# Altium schematic sheet POWER.SchDoc
size A3
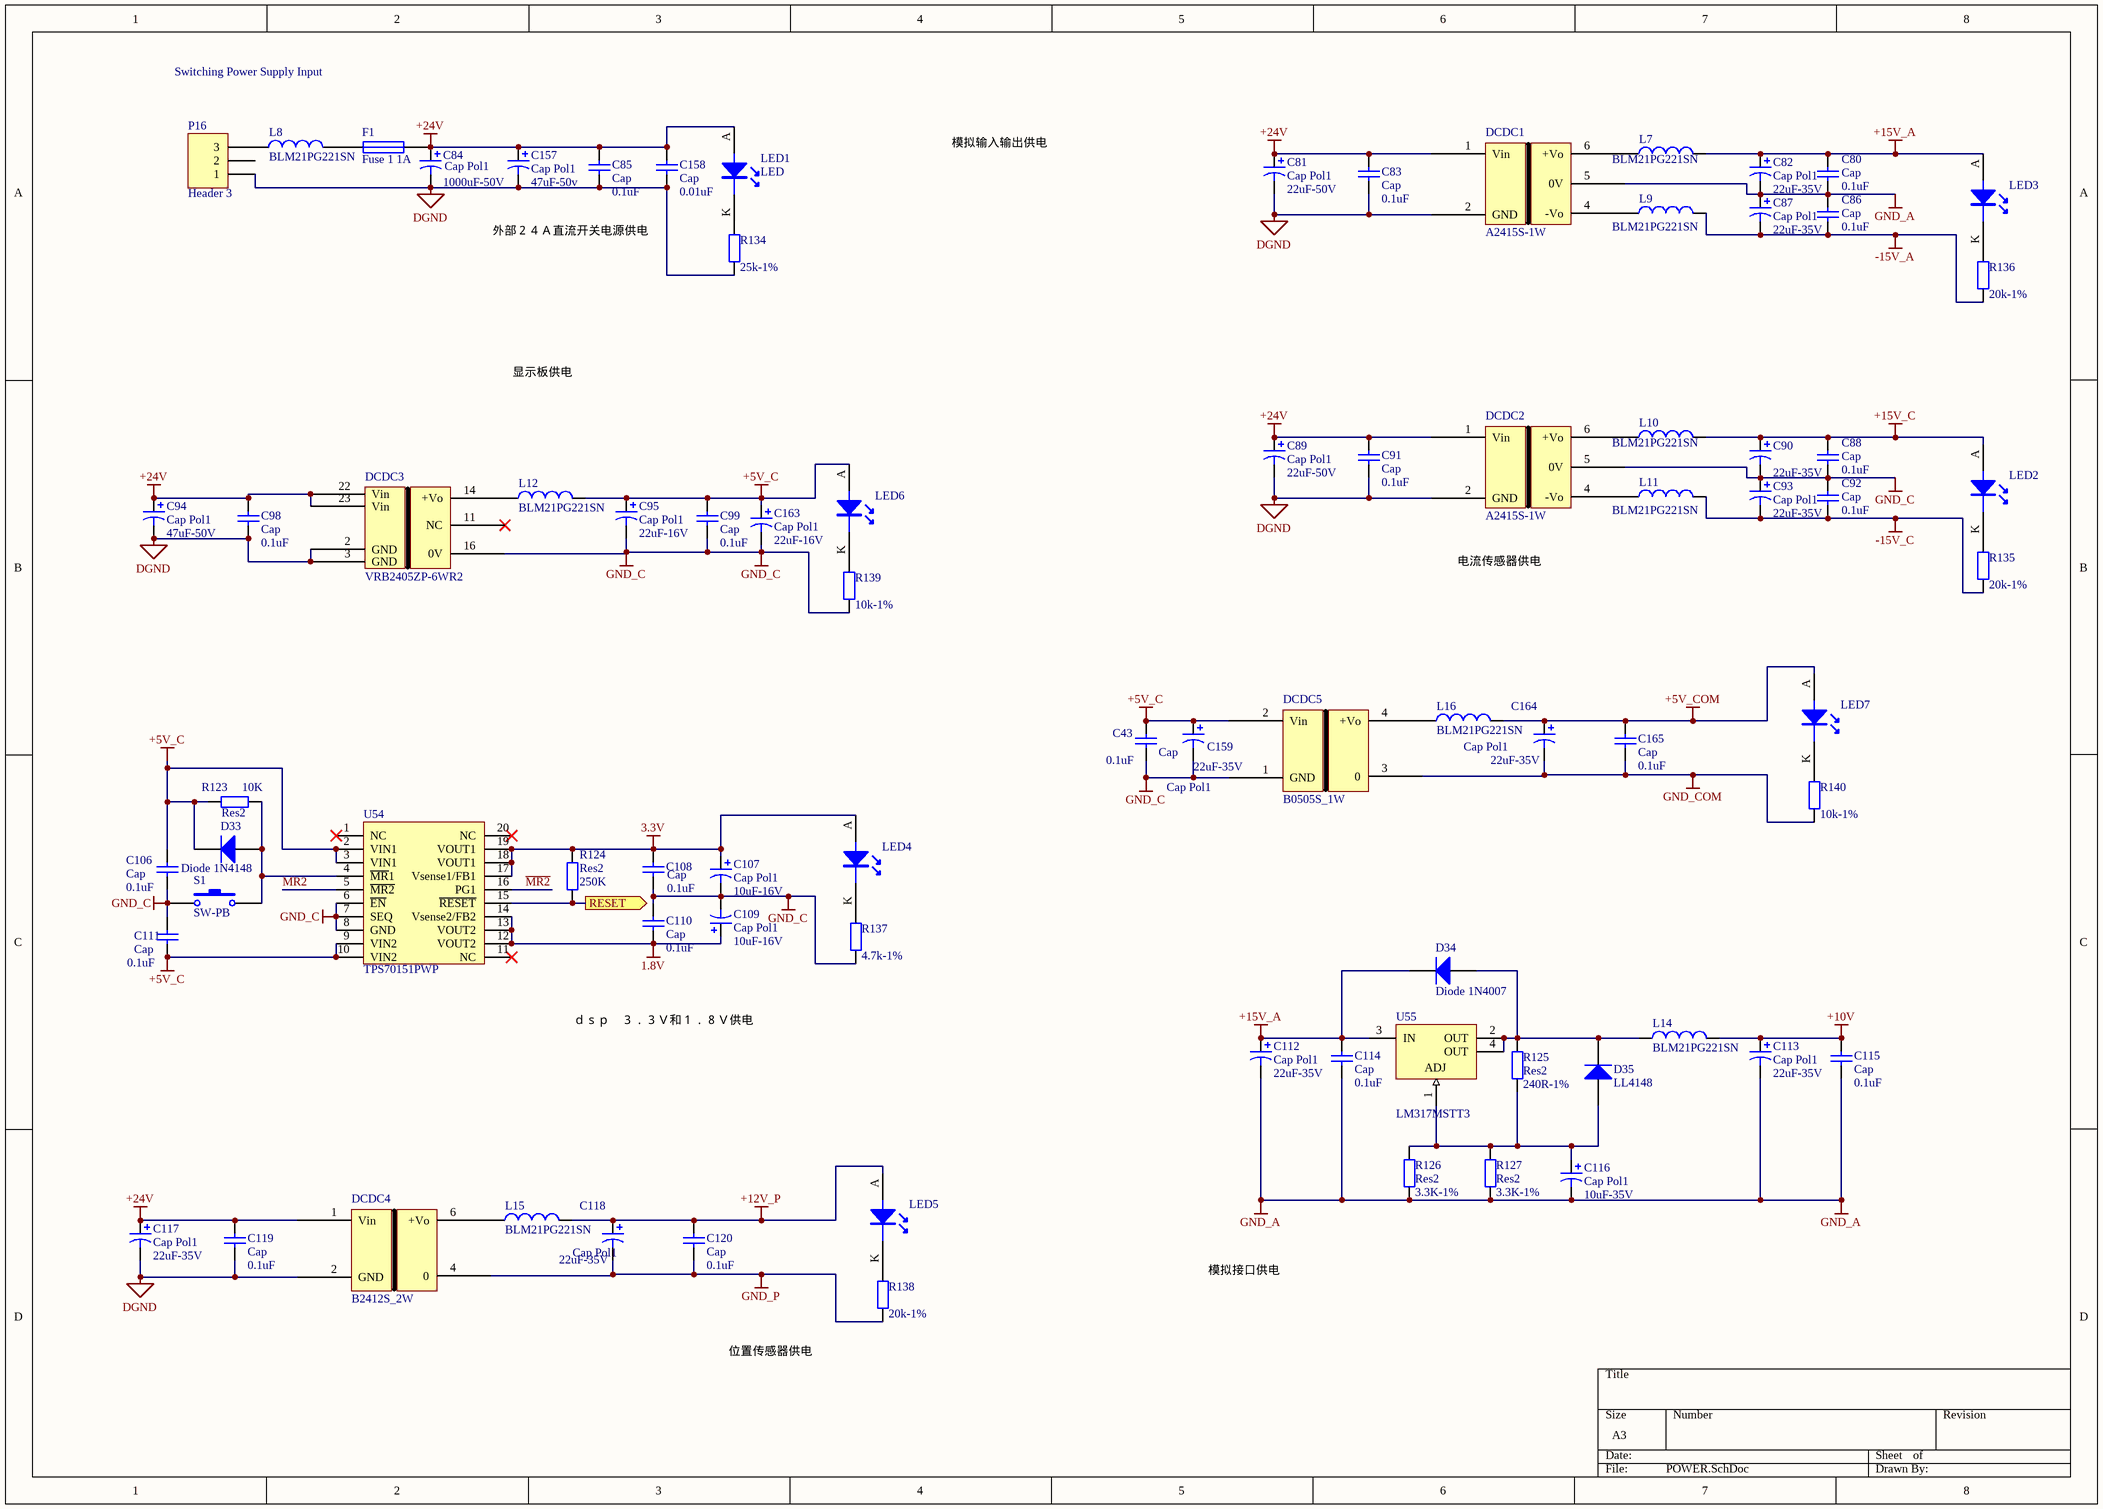
[diagram p0: POWER.SchDoc]

## Parts
C43  Cap  value 0.1uF  [1206]
C80  Cap  value 0.1uF  [1206]
C81  Cap Pol1  value 22uF-50V  [7343]
C82  Cap Pol1  value 22uF-35V  [7343]
C83  Cap  value 0.1uF  [1206]
C84  Cap Pol1  value 1000uF-50V  [电解电容1000uF]
C85  Cap  value 0.1uF  [1206]
C86  Cap  value 0.1uF  [1206]
C87  Cap Pol1  value 22uF-35V  [7343]
C88  Cap  value 0.1uF  [1206]
C89  Cap Pol1  value 22uF-50V  [7343]
C90  value 22uF-35V  [7343]  (hidden comment: Cap Pol1)
C91  Cap  value 0.1uF  [1206]
C92  Cap  value 0.1uF  [1206]
C93  Cap Pol1  value 22uF-35V  [7343]
C94  Cap Pol1  value 47uF-50V  [电解电容47uf]
C95  Cap Pol1  value 22uF-16V  [7343]
C98  Cap  value 0.1uF  [1206]
C99  Cap  value 0.1uF  [1206]
C106  Cap  value 0.1uF  [1206]
C107  Cap Pol1  value 10uF-16V  [1206]
C108  Cap  value 0.1uF  [1206]
C109  Cap Pol1  value 10uF-16V  [1206]
C110  Cap  value 0.1uF  [1206]
C111  Cap  value 0.1uF  [1206]
C112  Cap Pol1  value 22uF-35V  [7343]
C113  Cap Pol1  value 22uF-35V  [7343]
C114  Cap  value 0.1uF  [1206]
C115  Cap  value 0.1uF  [1206]
C116  Cap Pol1  value 10uF-35V  [1206]
C117  Cap Pol1  value 22uF-35V  [7343]
C118  Cap Pol1  value 22uF-35V  [7343]
C119  Cap  value 0.1uF  [1206]
C120  Cap  value 0.1uF  [1206]
C157  Cap Pol1  value 47uF-50v  [电解电容47uf]
C158  Cap  value 0.01uF  [1206]
C159  Cap Pol1  value 22uF-35V  [7343]
C163  Cap Pol1  value 22uF-16V  [7343]
C164  Cap Pol1  value 22uF-35V  [7343]
C165  Cap  value 0.1uF  [1206]
D33  Diode 1N4148  [SOD-80/MLL34]
D34  Diode 1N4007  [SMA]
D35  LL4148  [SMA]
DCDC1  A2415S-1W  [NPSIP7]
DCDC2  A2415S-1W  [NPSIP7]
DCDC3  VRB2405ZP-6WR2  [DIP24]
DCDC4  B2412S_2W  [NPSIP7A_B2412s2]
DCDC5  B0505S_1W  [B0505]
F1  Fuse 1 1A  [1206]
L7  BLM21PG221SN  [2012]
L8  BLM21PG221SN  [2012]
L9  BLM21PG221SN  [2012]
L10  BLM21PG221SN  [2012]
L11  BLM21PG221SN  [2012]
L12  BLM21PG221SN  [2012]
L14  BLM21PG221SN  [2012]
L15  BLM21PG221SN  [2012]
L16  BLM21PG221SN  [2012]
LED1  LED  [0805D]
LED2  LED  [0805D]  (value not drawn)
LED3  LED  [0805D]  (value not drawn)
LED4  LED  [0805D]  (value not drawn)
LED5  LED  [0805D]  (value not drawn)
LED6  LED  [0805D]  (value not drawn)
LED7  LED  [0805D]  (value not drawn)
P16  Header 3  [PHENOX-3]
R123  Res2  value 10K  [1206]
R124  Res2  value 250K  [1206]
R125  Res2  value 240R-1%  [1206]
R126  Res2  value 3.3K-1%  [1206]
R127  Res2  value 3.3K-1%  [1206]
R134  value 25k-1%  [1206]  (hidden comment: Res2)
R135  value 20k-1%  [1206]  (hidden comment: Res2)
R136  value 20k-1%  [1206]  (hidden comment: Res2)
R137  value 4.7k-1%  [1206]  (hidden comment: Res2)
R138  value 20k-1%  [1206]  (hidden comment: Res2)
R139  value 10k-1%  [1206]  (hidden comment: Res2)
R140  value 10k-1%  [1206]  (hidden comment: Res2)
S1  SW-PB  [B3F4050]
U54  TPS70151PWP  [tssop20]
U55  LM317MSTT3  [SOT223-4N]

## Ports
RESET (out)

## Nets
1.8V: C109.1 C110.1 U54.12(VOUT2) U54.13(VOUT2) U54.14(Vsense2/FB2)
3.3V: C107.1 C108.2 LED4.A R124.2 U54.17(Vsense1/FB1) U54.18(VOUT1) U54.19(VOUT1)
+5V_C: C43.2 C95.1 C99.2 C106.2 C111.1 C159.1 C163.1 D33.2(K) DCDC5.2(Vin) L12.2 LED6.A R123.2 U54.2(VIN1) U54.3(VIN1) U54.9(VIN2) U54.10(VIN2)
+5V_COM: C164.1 C165.2 L16.2 LED7.A
+10V: C113.1 C115.2 L14.2
+12V_P: C118.1 C120.2 L15.2 LED5.A
+15V_A: C80.2 C82.1 C112.1 C114.2 D34.2(K) L7.2 LED3.A U55.3(IN)
+15V_C: C88.2 C90.1 L10.2 LED2.A
+24V: C81.1 C83.2 C84.1 C85.2 C89.1 C91.2 C94.1 C98.2 C117.1 C119.2 C157.1 C158.1 DCDC1.1(Vin) DCDC2.1(Vin) DCDC3.22(Vin) DCDC3.23(Vin) DCDC4.1(Vin) F1.2 LED1.A
-15V_A: C86.1 C87.2 L9.2 R136.1
-15V_C: C92.1 C93.2 L11.2 R135.1
DGND: C81.2 C83.1 C84.2 C85.1 C89.2 C91.1 C94.2 C98.1 C117.2 C119.1 C157.2 C158.2 DCDC1.2(GND) DCDC2.2(GND) DCDC3.2(GND) DCDC3.3(GND) DCDC4.2(GND) P16.1 R134.1
GND_A: C80.1 C82.2 C86.2 C87.1 C112.2 C113.2 C114.1 C115.1 C116.2 DCDC1.5(0V) R126.1 R127.1
GND_C: C43.1 C88.1 C90.2 C92.2 C93.1 C95.2 C99.1 C106.1 C107.2 C108.1 C109.2 C110.2 C111.2 C159.2 C163.2 DCDC2.5(0V) DCDC3.16(0V) DCDC5.1(GND) R137.1 R139.1 S1.1 U54.6(~{EN}) U54.7(SEQ) U54.8(GND)
GND_COM: C164.2 C165.1 DCDC5.3(0) R140.1
GND_P: C118.2 C120.1 DCDC4.4(0) R138.1
~{MR2}: U54.5(~{MR2}) U54.16(PG1)
RESET: R124.1 U54.15(~{RESET}) ; port RESET
NetC116_1: C116.1 D35.1(A) R125.1 R126.2 R127.2 U55.1(ADJ)
NetD33_1: D33.1(A) R123.1 S1.2 U54.4(~{MR}1)
NetD34_1: D34.1(A) D35.2(K) L14.1 R125.2 U55.2(OUT) U55.4(OUT)
NetDCDC1_4: DCDC1.4(-Vo) L9.1
NetDCDC1_6: DCDC1.6(+Vo) L7.1
NetDCDC2_4: DCDC2.4(-Vo) L11.1
NetDCDC2_6: DCDC2.6(+Vo) L10.1
NetDCDC3_14: DCDC3.14(+Vo) L12.1
NetDCDC4_6: DCDC4.6(+Vo) L15.1
NetDCDC5_4: DCDC5.4(+Vo) L16.1
NetF1_1: F1.1 L8.2
NetL8_1: L8.1 P16.3
NetLED1_K: LED1.K R134.2
NetLED2_K: LED2.K R135.2
NetLED3_K: LED3.K R136.2
NetLED4_K: LED4.K R137.2
NetLED5_K: LED5.K R138.2
NetLED6_K: LED6.K R139.2
NetLED7_K: LED7.K R140.2

Not connected (* = marked no-connect by the designer): DCDC3 11(NC)*; P16 2; U54 1(NC)* 11(NC)* 20(NC)*

## Notes on the sheet
- Switching Power Supply Input
- 模拟输入输出供电
- (near R134) 外部２４Ａ直流开关电源供电
- 显示板供电
- 电流传感器供电
- ｄｓｐ　３．３Ｖ和１．８Ｖ供电
- 模拟接口供电
- (near R138) 位置传感器供电

## Library data of the parts
C43 C80 C83 C85 C86 C88 C91 C92 C98 C99 C106 C108 C110 C111 C114 C115 C119 C120 C158 C165 = Cap: Capacitor; Published: 8-Jun-2000; LatestRevisionDate: 17-Jul-2002; LatestRevisionNote: Re-released for DXP Platform.; PackageReference: RAD-0.3; Publisher: Altium Limited
C81 C82 C84 C87 C89 C90 C93-C95 C107 C109 C112 C113 C116-C118 C157 C159 C163 C164 = Cap Pol1: Polarized Capacitor (Radial); Published: 8-Jun-2000; LatestRevisionDate: 17-Jul-2002; LatestRevisionNote: Re-released for DXP Platform.; PackageReference: RB7.6-15; Publisher: Altium Limited
D33 = Diode 1N4148: High Conductance Fast Diode; Published: 8-Jun-2000; LatestRevisionDate: 17-Jul-2002; LatestRevisionNote: Re-released for DXP Platform.; DatasheetVersion: 1997; PackageReference: DO-35; Publisher: Altium Limited; Code_JEDEC: DO-204-AH; ComponentLink1Description: Manufacturer Link; ComponentLink1URL: http://www.fairchildsemi.com/; ComponentLink2Description: Datasheet; ComponentLink2URL: http://www.fairchildsemi.com/ds/1N%2F1N4148.pdf
D34 D35 = Diode 1N4007: 1 Amp General Purpose Rectifier; Published: 8-Jun-2000; LatestRevisionDate: 17-Jul-2002; LatestRevisionNote: Re-released for DXP Platform.; DatasheetVersion: 1998; PackageVersion: Aug-1999; PackageReference: DO-41; Publisher: Altium Limited; Code_JEDEC: DO-204-AL; ComponentLink1Description: Manufacturer Link; ComponentLink1URL: http://www.fairchildsemi.com/; ComponentLink2Description: Datasheet; ComponentLink2URL: http://www.fairchildsemi.com/ds/1N%2F1N4001.pdf
DCDC3 = WRB2405ZP-3WR2
DCDC5 = newB0505
F1 = Fuse 1: Fuse; Published: 8-Jun-2000; LatestRevisionDate: 17-Jul-2002; LatestRevisionNote: Re-released for DXP Platform.; PackageReference: PIN-W2/E2.8; Publisher: Altium Limited
L7-L12 L14-L16 = Inductor: Code_IEC: 1005; Value: 10mH; Published: 8-Jun-2000; LatestRevisionDate: 29-May-2009; LatestRevisionNote: IPC-7351 Footprint Added.; PackageReference: 0402-A; Publisher: Altium Limited; PackageDescription: Chip Inductor; Code_JEITA: 0402
P16 = Header 3: Header, 3-Pin; LatestRevisionDate: 17-Jul-2002; LatestRevisionNote: Re-released for DXP Platform.; Publisher: Altium Limited
R123-R127 R134-R140 = Res2: Resistor; Published: 8-Jun-2000; LatestRevisionDate: 17-Jul-2002; LatestRevisionNote: Re-released for DXP Platform.; PackageReference: AXIAL-0.4; Publisher: Altium Limited
S1 = SW-PB: Switch; Published: 24-Mar-1999; LatestRevisionDate: 17-Jul-2002; LatestRevisionNote: Re-released for DXP Platform.; PackageReference: SPST-2; Publisher: Altium Limited
U55 = LM317MSTT3: Three-Terminal Adjustable Output Positive Voltage Regulator; Note: Pin 2 is electrically connected to Pin 4 (TAB); Published: 15-Apr-2002; DatasheetVersion: Nov-1999; PackageVersion: Nov-1999; PackageReference: 318E-04; Publisher: Altium Limited; PackageDescription: SOT-223/SC-73; 4 Leads; Body 6.7 x 7.3 mm, inc. leads (LxW max); ComponentLink1Description: Manufacturer Link; ComponentLink1URL: http://www.onsemi.com/site/products/taxonomy/0,4438,503,00.html; ComponentLink2Description: Datasheet; ComponentLink2URL: http://www.onsemi.com/pub/Collateral/LM317M-D.PDF